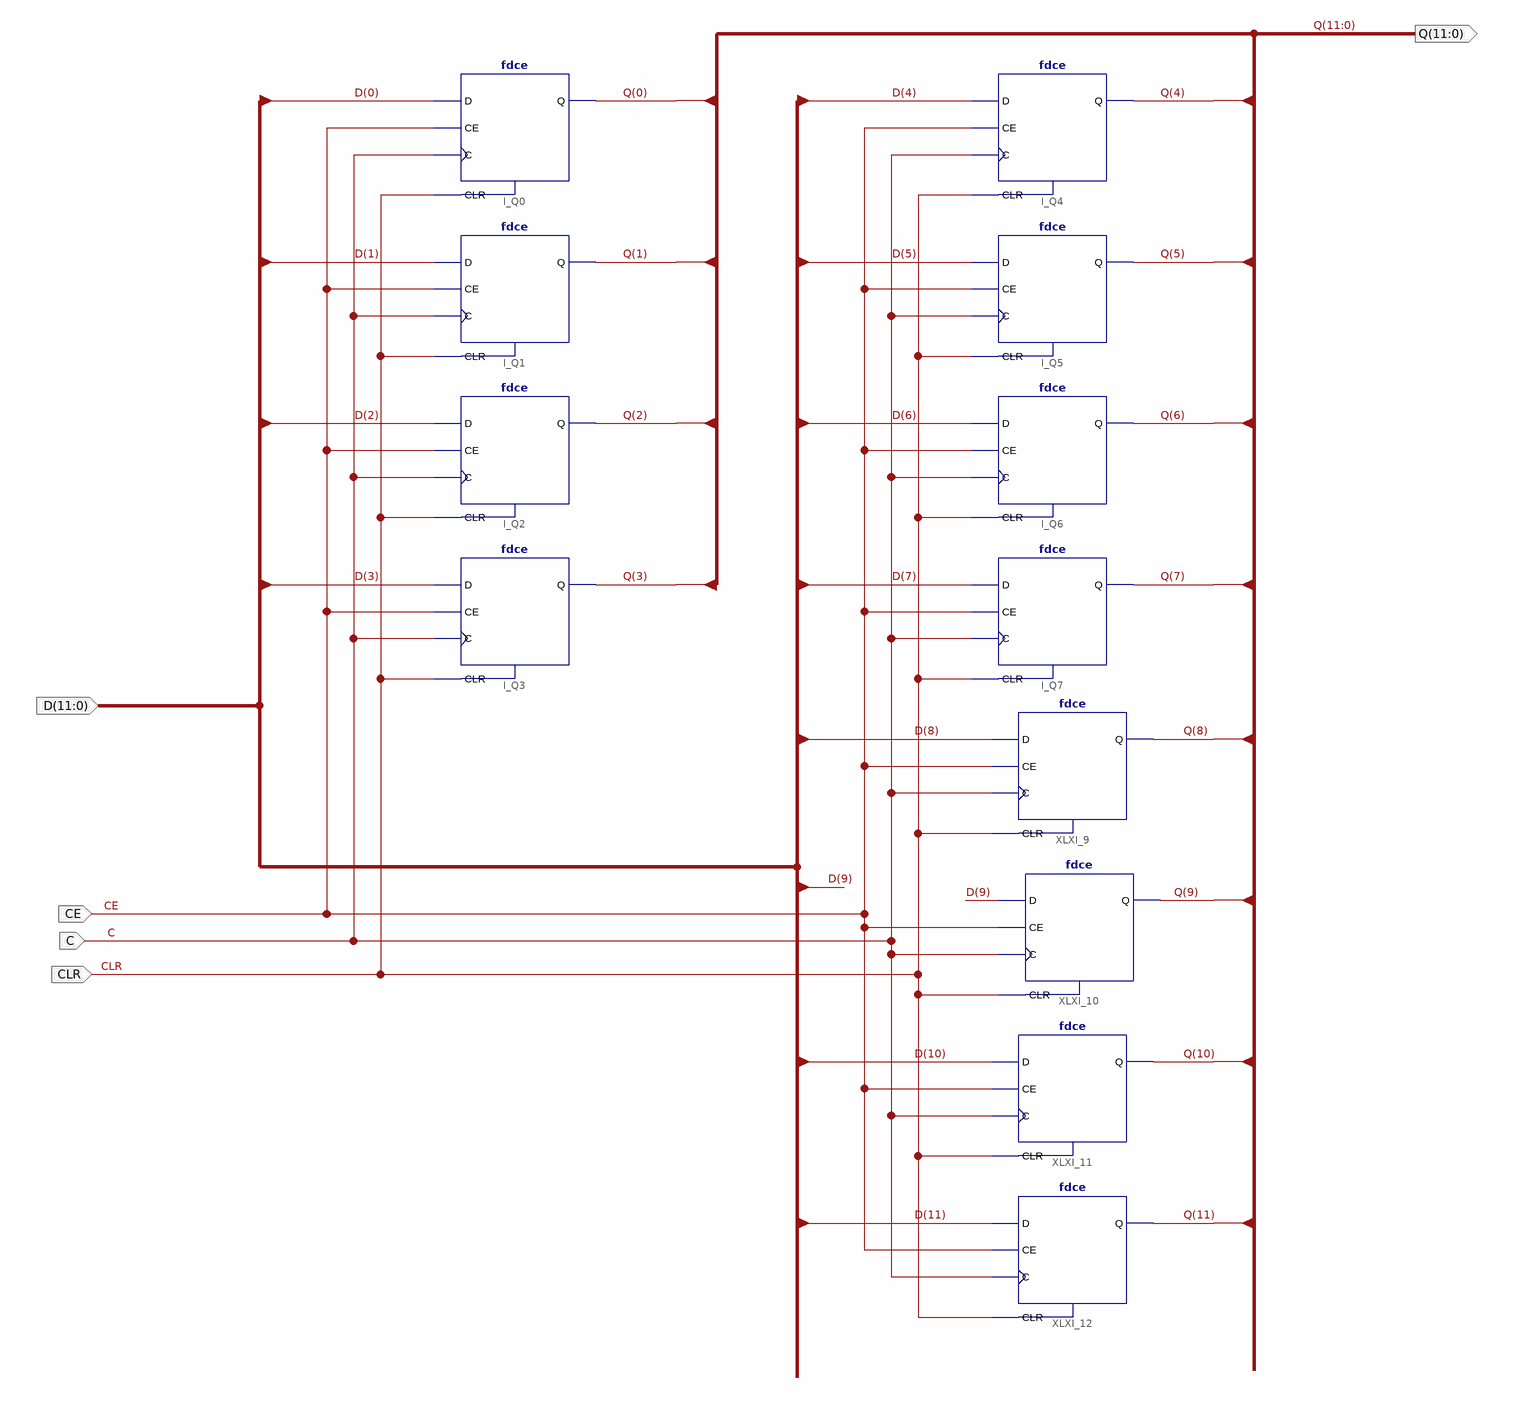
[diagram p0: schematic sheet 1]
// Xilinx ISE schematic FD12CE.sch (spartan3e) as structural Verilog: 12 symbols, 5 ports
module FD12CE (
  input  [11:0] D,
  input  CE,
  input  C,
  input  CLR,
  output [11:0] Q
);

  fdce I_Q7 (.C(C), .CE(CE), .CLR(CLR), .D(D[7]), .Q(Q[7]));
  fdce I_Q6 (.C(C), .CE(CE), .CLR(CLR), .D(D[6]), .Q(Q[6]));
  fdce I_Q4 (.C(C), .CE(CE), .CLR(CLR), .D(D[4]), .Q(Q[4]));
  fdce I_Q5 (.C(C), .CE(CE), .CLR(CLR), .D(D[5]), .Q(Q[5]));
  fdce I_Q0 (.C(C), .CE(CE), .CLR(CLR), .D(D[0]), .Q(Q[0]));
  fdce I_Q1 (.C(C), .CE(CE), .CLR(CLR), .D(D[1]), .Q(Q[1]));
  fdce I_Q2 (.C(C), .CE(CE), .CLR(CLR), .D(D[2]), .Q(Q[2]));
  fdce I_Q3 (.C(C), .CE(CE), .CLR(CLR), .D(D[3]), .Q(Q[3]));
  fdce XLXI_9 (.C(C), .CE(CE), .CLR(CLR), .D(D[8]), .Q(Q[8]));
  fdce XLXI_10 (.C(C), .CE(CE), .CLR(CLR), .D(D[9]), .Q(Q[9]));
  fdce XLXI_11 (.C(C), .CE(CE), .CLR(CLR), .D(D[10]), .Q(Q[10]));
  fdce XLXI_12 (.C(C), .CE(CE), .CLR(CLR), .D(D[11]), .Q(Q[11]));
endmodule
